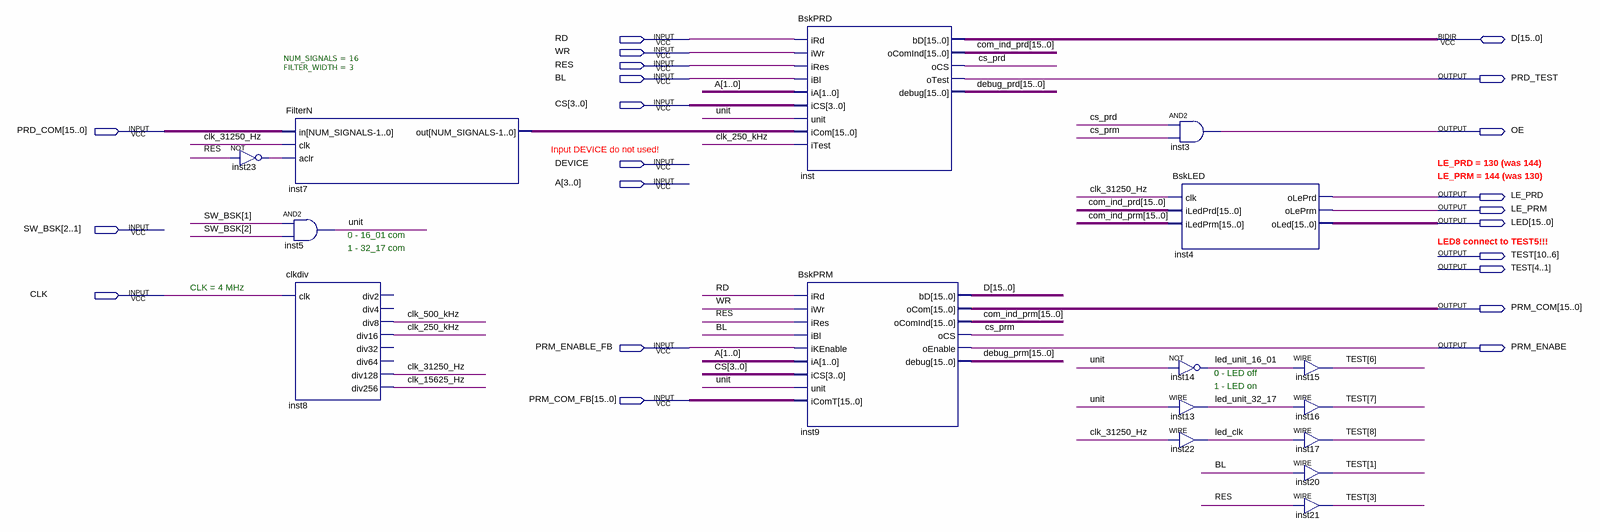
[diagram p0: schematic sheet]
// Quartus schematic Plis_Bsk_v3_01.bdf as structural Verilog: 16 symbols, 22 pins
module Plis_Bsk_v3_01 (
  input  RD,
  input  WR,
  input  RES,
  input  BL,
  input  [3:0] CS,
  input  [15:0] PRD_COM,
  input  DEVICE,
  input  [3:0] A,
  input  [2:1] SW_BSK,
  input  CLK,
  input  PRM_ENABLE_FB,
  input  [15:0] PRM_COM_FB,
  inout  [15:0] D,
  output PRD_TEST,
  output OE,
  output LE_PRD,
  output LE_PRM,
  output [15:0] LED,
  output [10:1] TEST,
  output [15:0] PRM_COM,
  output PRM_ENABE
);

  wire clk_250_kHz, clk_500_kHz, clk_15625_Hz, clk_31250_Hz, cs_prd, cs_prm, inst23_out, led_clk,
       led_unit_16_01, led_unit_32_17, unit;
  wire [15:0] com_ind_prd, com_ind_prm, debug_prd, debug_prm, inst7_out;

  not inst23 (inst23_out, RES);
  FilterN #(.NUM_SIGNALS(16), .FILTER_WIDTH(3)) inst7 (
    .in(PRD_COM), .clk(clk_31250_Hz), .aclr(inst23_out), .out(inst7_out));
  and inst5 (unit, SW_BSK[1], SW_BSK[2]);
  clkdiv inst8 (
    .clk(CLK), .div8(clk_500_kHz), .div16(clk_250_kHz), .div128(clk_31250_Hz), .div256(clk_15625_Hz));  // open: div2, div4, div32, div64
  BskPRD inst (
    .iRd(RD), .iWr(WR), .iRes(RES), .iBl(BL), .iA(A[1:0]), .iCS(CS), .unit(unit), .iCom(inst7_out),
    .iTest(clk_250_kHz), .oComInd(com_ind_prd), .oCS(cs_prd), .oTest(PRD_TEST), .debug(debug_prd), .bD(D));
  BskPRM inst9 (
    .iRd(RD), .iWr(WR), .iRes(RES), .iBl(BL), .iKEnable(PRM_ENABLE_FB), .iA(A[1:0]), .iCS(CS), .unit(unit),
    .iComT(PRM_COM_FB), .oCom(PRM_COM), .oComInd(com_ind_prm), .oCS(cs_prm), .oEnable(PRM_ENABE),
    .debug(debug_prm), .bD(D));
  and inst3 (OE, cs_prd, cs_prm);
  BskLED inst4 (
    .clk(clk_31250_Hz), .iLedPrd(com_ind_prd), .iLedPrm(com_ind_prm), .oLePrd(LE_PRD), .oLePrm(LE_PRM),
    .oLed(LED));
  not inst14 (led_unit_16_01, unit);
  assign led_unit_32_17 = unit;  // WIRE inst13
  assign led_clk = clk_31250_Hz;  // WIRE inst22
  assign TEST[6] = led_unit_16_01;  // WIRE inst15
  assign TEST[7] = led_unit_32_17;  // WIRE inst16
  assign TEST[8] = led_clk;  // WIRE inst17
  assign TEST[1] = BL;  // WIRE inst20
  assign TEST[3] = RES;  // WIRE inst21

  // Notes on the sheet:
  //   Input DEVICE do not used!
  //   LE_PRD = 130 (was 144)
  //   LE_PRM = 144 (was 130)
  //   0 - 16_01 com
  //   LED8 connect to TEST5!!!
  //   1 - 32_17 com
  //   CLK = 4 MHz
  //   0 - LED off
  //   1 - LED on
endmodule
